# Altium project controller.PrjPcb
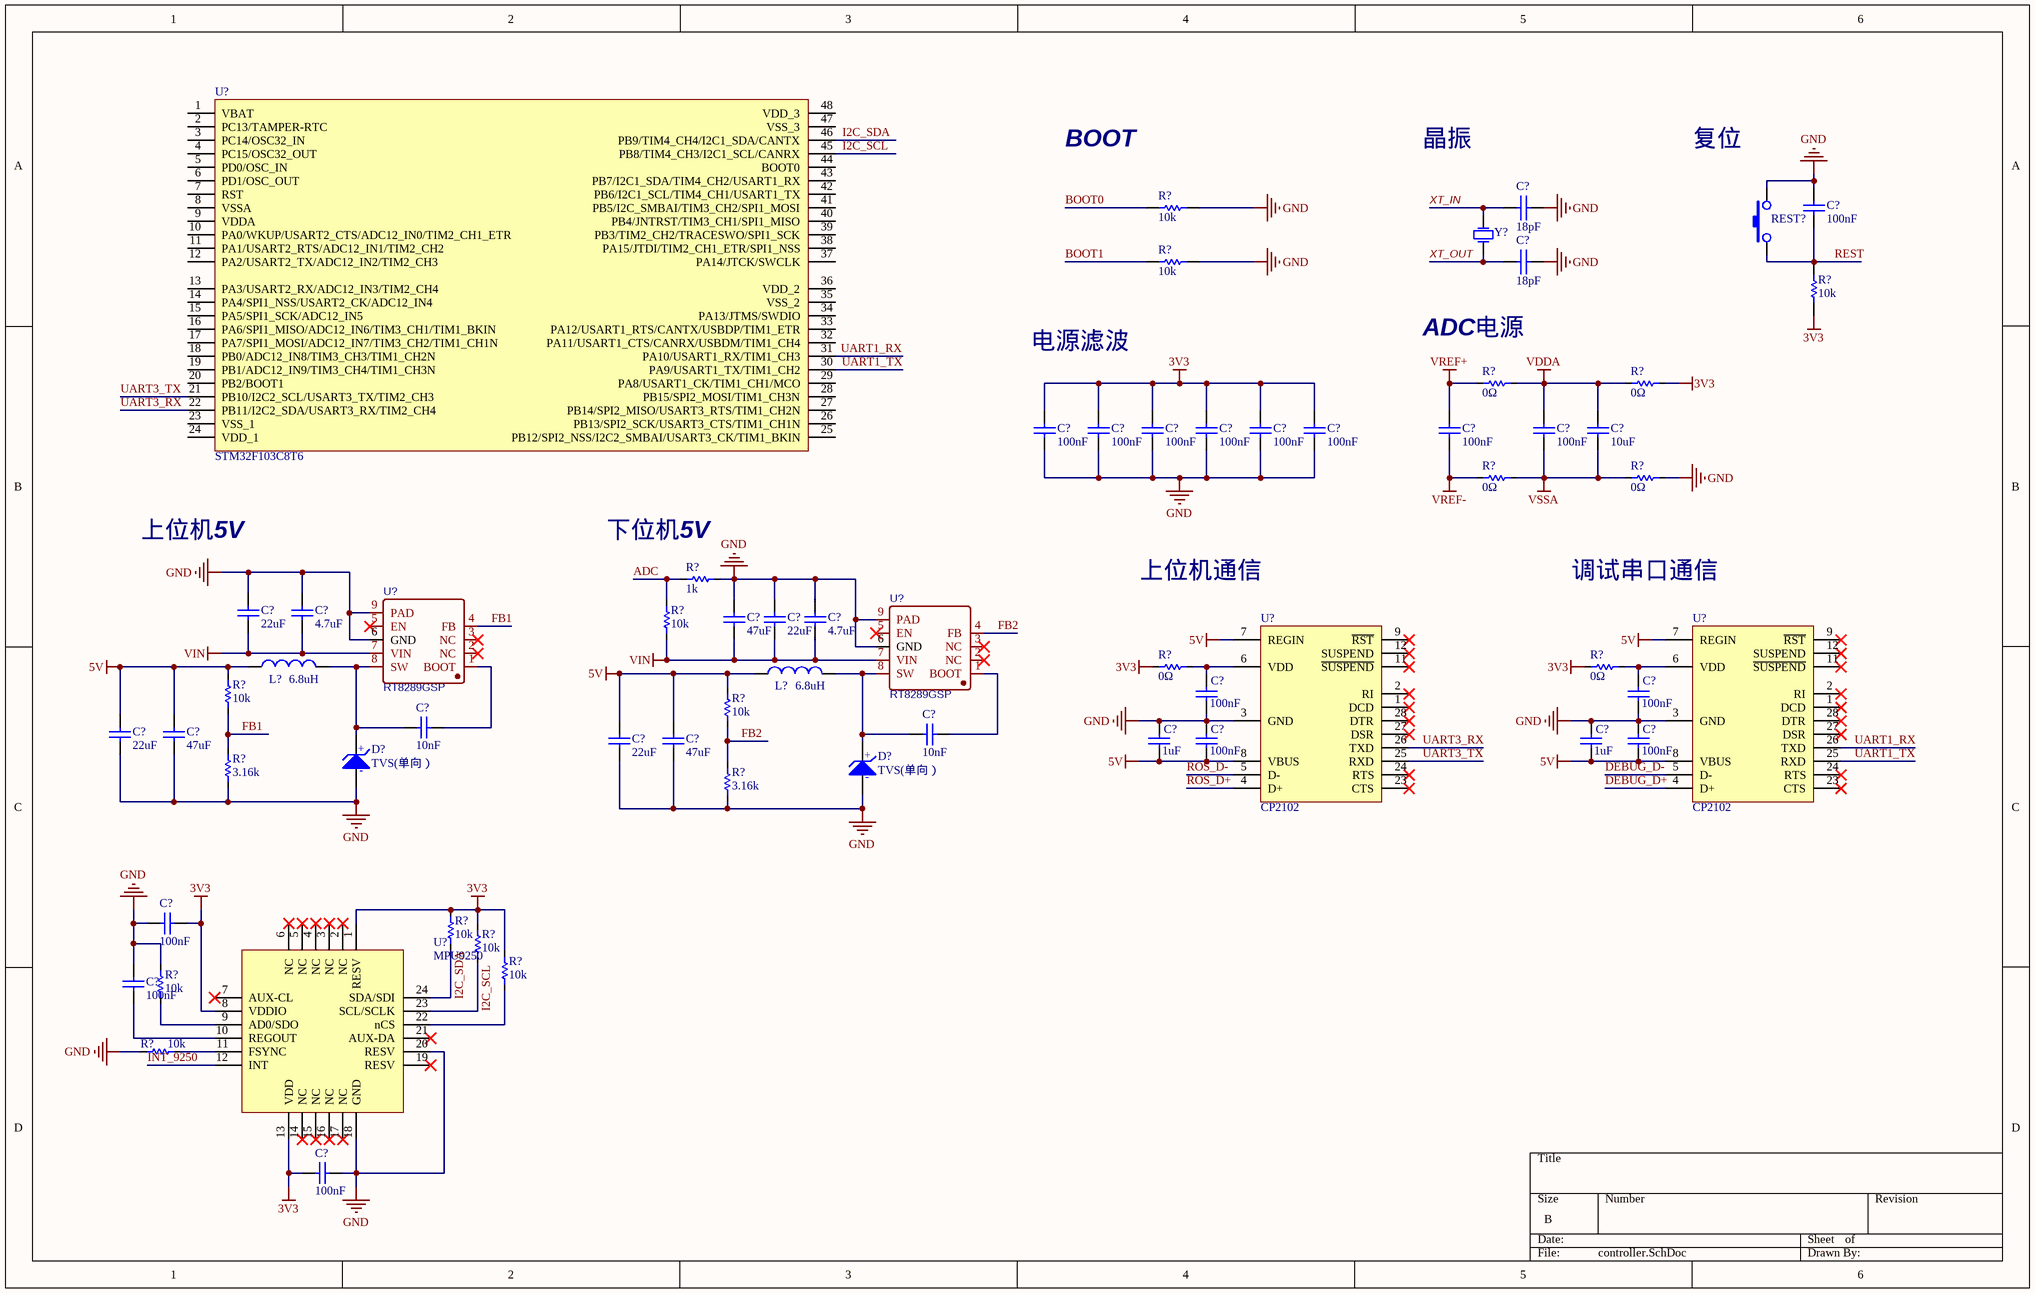
[diagram p0: controller.SchDoc]
1 sheet, 64 parts. Net scope: global (net labels, ports and power ports of the same name join across sheets).

## Sheet controller.SchDoc
size B; SheetNumber: 1; SheetTotal: 1

### Parts
(Parts that share a designator on the sheet are numbered #1, #2 ... from top to bottom, then left to right.)
C?#1  18pF  [0603C]
C?#2  100nF  [0603C]
C?#3  18pF  [0603C]
C?#4  100nF  [0603C]
C?#5  100nF  [0603C]
C?#6  100nF  [0603C]
C?#7  100nF  [0603C]
C?#8  100nF  [0603C]
C?#9  100nF  [0603C]
C?#10  100nF  [0603C]
C?#11  100nF  [0603C]
C?#12  10uF  [0805c]
C?#13  22uF  [0805c]
C?#14  4.7uF  [0805c]
C?#15  47uF  [0805c]
C?#16  22uF  [0805c]
C?#17  4.7uF  [0805c]
C?#18  100nF  [0603C]
C?#19  100nF  [0603C]
C?#20  10nF  [0603C]
C?#21  22uF  [0805c]
C?#22  47uF  [0805c]
C?#23  10nF  [0603C]
C?#24  22uF  [0805c]
C?#25  47uF  [0805c]
C?#26  1uF  [0603C]
C?#27  100nF  [0603C]
C?#28  1uF  [0603C]
C?#29  100nF  [0603C]
C?#30  100nF  [0603C]
C?#31  100nF  [0603C]
C?#32  100nF  [0603C]
D?#1  TVS(单向）  [SMB/DO-214AA]
D?#2  TVS(单向）  [SMB/DO-214AA]
L?#1  6.8uH  [XAL6060]
L?#2  6.8uH  [XAL6060]
R?#1  10k  [0603R]
R?#2  10k  [0603R]
R?#3  10k  [0603R]
R?#4  0Ω  [0603R]
R?#5  0Ω  [0603R]
R?#6  0Ω  [0603R]
R?#7  0Ω  [0603R]
R?#8  1k  [0603R]
R?#9  10k  [0603R]
R?#10  0Ω  [0603R]
R?#11  0Ω  [0603R]
R?#12  10k  [0603R]
R?#13  10k  [0603R]
R?#14  3.16k  [0603R]
R?#15  3.16k  [0603R]
R?#16  10k  [0603R]
R?#17  10k  [0603R]
R?#18  10k  [0603R]
R?#19  10k  [0603R]
R?#20  10k  [0603R]
REST?  KEY  [SMD-3X6X2.5]  (value not drawn)
U?#1  STM32F103C8T6  [LQFP_48]
U?#2  RT8289GSP  [RT8289GSP]
U?#3  RT8289GSP  [RT8289GSP]
U?#4  CP2102  [QFN50P500X500X90-28N(CP2101)]
U?#5  CP2102  [QFN50P500X500X90-28N(CP2101)]
U?#6  MPU9250  [QFN24 3x3]
Y?  XTAL  [NX5032GA]  (value not drawn)

### Nets
3V3: C?#4.2 C?#5.2 C?#6.2 C?#7.2 C?#8.2 C?#9.2 C?#30.1 C?#32.2 R?#3.2 R?#5.2 R?#10.2 R?#11.2 R?#16.2 R?#17.2 R?#18.2 U?#6.1(RESV) U?#6.8(VDDIO) U?#6.13(VDD)
5V: C?#21.2 C?#22.2 C?#24.2 C?#25.2 C?#26.2 C?#27.2 C?#28.2 C?#29.2 L?#1.1 L?#2.1 R?#12.2 R?#13.2 U?#4.7(REGIN) U?#4.8(VBUS) U?#5.7(REGIN) U?#5.8(VBUS)
GND: C?#1.2 C?#2.2 C?#3.2 C?#4.1 C?#5.1 C?#6.1 C?#7.1 C?#8.1 C?#9.1 C?#13.2 C?#14.2 C?#15.2 C?#16.2 C?#17.2 C?#18.2 C?#19.2 C?#21.1 C?#22.1 C?#24.1 C?#25.1 C?#26.1 C?#27.1 C?#28.1 C?#29.1 C?#30.2 C?#31.2 C?#32.1 D?#1.1 D?#2.1 R?#1.1 R?#2.1 R?#7.2 R?#8.1 R?#14.1 R?#15.1 R?#19.2 R?#20.1 REST?.3 U?#2.6(GND) U?#2.9(PAD) U?#3.6(GND) U?#3.9(PAD) U?#4.3(GND) U?#4.29(PAD) U?#5.3(GND) U?#5.29(PAD) U?#6.18(GND) U?#6.20(RESV)
VDDA: C?#11.2 C?#12.2 R?#4.2 R?#5.1
VIN: C?#13.1 C?#14.1 C?#15.1 C?#16.1 C?#17.1 R?#9.2 U?#2.7(VIN) U?#3.7(VIN)
VREF+: C?#10.2 R?#4.1
VREF-: C?#10.1 R?#6.1
VSSA: C?#11.1 C?#12.1 R?#6.2 R?#7.1
ADC: R?#8.2 R?#9.1
BOOT0: R?#1.2
BOOT1: R?#2.2
DEBUG_D+: U?#5.4(D+)
DEBUG_D-: U?#5.5(D-)
FB1: R?#12.1 R?#14.2 U?#2.4(FB)
FB2: R?#13.1 R?#15.2 U?#3.4(FB)
I2C_SCL: R?#17.1 U?#1.45(PB8/TIM4_CH3/I2C1_SCL/CANRX) U?#6.23(SCL/SCLK)
I2C_SDA: R?#16.1 U?#1.46(PB9/TIM4_CH4/I2C1_SDA/CANTX) U?#6.24(SDA/SDI)
INT_9250: U?#6.12(INT)
REST: C?#2.1 R?#3.1 REST?.1
ROS_D+: U?#4.4(D+)
ROS_D-: U?#4.5(D-)
UART1_RX: U?#1.31(PA10/USART1_RX/TIM1_CH3) U?#5.26(TXD)
UART1_TX: U?#1.30(PA9/USART1_TX/TIM1_CH2) U?#5.25(RXD)
UART3_RX: U?#1.22(PB11/I2C2_SDA/USART3_RX/TIM2_CH4) U?#4.26(TXD)
UART3_TX: U?#1.21(PB10/I2C2_SCL/USART3_TX/TIM2_CH3) U?#4.25(RXD)
XT_IN: C?#1.1 Y?.1(OSC1)
XT_OUT: C?#3.1 Y?.2(OSC2)
NetC?#18_1: C?#18.1 R?#10.1 U?#4.6(VDD)
NetC?#19_1: C?#19.1 R?#11.1 U?#5.6(VDD)
NetC?#20_1: C?#20.1 U?#2.1(BOOT)
NetC?#20_2: C?#20.2 D?#1.2 L?#1.2 U?#2.8(SW)
NetC?#23_1: C?#23.1 U?#3.1(BOOT)
NetC?#23_2: C?#23.2 D?#2.2 L?#2.2 U?#3.8(SW)
NetC?#31_1: C?#31.1 U?#6.10(REGOUT)
NetR?#18_1: R?#18.1 U?#6.22(nCS)
NetR?#19_1: R?#19.1 U?#6.9(AD0/SDO)
NetR?#20_2: R?#20.2 U?#6.11(FSYNC)

Not connected (* = marked no-connect by the designer): U?#1 1(VBAT) 2(PC13/TAMPER-RTC) 3(PC14/OSC32_IN) 4(PC15/OSC32_OUT) 5(PD0/OSC_IN) 6(PD1/OSC_OUT) 7(RST) 8(VSSA) 9(VDDA) 10(PA0/WKUP/USART2_CTS/ADC12_IN0/TIM2_CH1_ETR) 11(PA1/USART2_RTS/ADC12_IN1/TIM2_CH2) 12(PA2/USART2_TX/ADC12_IN2/TIM2_CH3) 13(PA3/USART2_RX/ADC12_IN3/TIM2_CH4) 14(PA4/SPI1_NSS/USART2_CK/ADC12_IN4) 15(PA5/SPI1_SCK/ADC12_IN5) 16(PA6/SPI1_MISO/ADC12_IN6/TIM3_CH1/TIM1_BKIN) 17(PA7/SPI1_MOSI/ADC12_IN7/TIM3_CH2/TIM1_CH1N) 18(PB0/ADC12_IN8/TIM3_CH3/TIM1_CH2N) 19(PB1/ADC12_IN9/TIM3_CH4/TIM1_CH3N) 20(PB2/BOOT1) 23(VSS_1) 24(VDD_1) 25(PB12/SPI2_NSS/I2C2_SMBAI/USART3_CK/TIM1_BKIN) 26(PB13/SPI2_SCK/USART3_CTS/TIM1_CH1N) 27(PB14/SPI2_MISO/USART3_RTS/TIM1_CH2N) 28(PB15/SPI2_MOSI/TIM1_CH3N) 29(PA8/USART1_CK/TIM1_CH1/MCO) 32(PA11/USART1_CTS/CANRX/USBDM/TIM1_CH4) 33(PA12/USART1_RTS/CANTX/USBDP/TIM1_ETR) 34(PA13/JTMS/SWDIO) 35(VSS_2) 36(VDD_2) 37(PA14/JTCK/SWCLK) 38(PA15/JTDI/TIM2_CH1_ETR/SPI1_NSS) 39(PB3/TIM2_CH2/TRACESWO/SPI1_SCK) 40(PB4/JNTRST/TIM3_CH1/SPI1_MISO) 41(PB5/I2C_SMBAI/TIM3_CH2/SPI1_MOSI) 42(PB6/I2C1_SCL/TIM4_CH1/USART1_TX) 43(PB7/I2C1_SDA/TIM4_CH2/USART1_RX) 44(BOOT0) 47(VSS_3) 48(VDD_3); U?#2 2(NC)* 3(NC)* 5(EN)*; U?#3 2(NC)* 3(NC)* 5(EN)*; U?#4 1(DCD)* 2(RI)* 9(~{RST})* 11(~{SUSPEND})* 12(SUSPEND)* 23(CTS)* 24(RTS)* 27(DSR)* 28(DTR)*; U?#5 1(DCD)* 2(RI)* 9(~{RST})* 11(~{SUSPEND})* 12(SUSPEND)* 23(CTS)* 24(RTS)* 27(DSR)* 28(DTR)*; U?#6 2(NC)* 3(NC)* 4(NC)* 5(NC)* 6(NC)* 7(AUX-CL)* 14(NC)* 15(NC)* 16(NC)* 17(NC)* 19(RESV)* 21(AUX-DA)*

### Notes on the sheet
- BOOT
- 晶振
- 复位
- 电源滤波
- ADC电源
- 上位机5V
- (near R?#8) 下位机5V
- 上位机通信
- 调试串口通信
- (in symbol TVS(单向）) +; -

### Library data of the parts
C?#1 C?#3 = CAP: 无极性电容
C?#2 C?#4-C?#32 = Cap: Capacitor; Value: 100pF; Published: 8-Jun-2000; LatestRevisionDate: 17-Jul-2002; LatestRevisionNote: Re-released for DXP Platform.; PackageReference: RAD-0.3; Publisher: Altium Limited; PackageDescription: Radial Cap, Thru-Hole; 2 Leads; 0.3 in Pin Spacing
L?#1 L?#2 = Inductor: Code_IEC: 1005; Value: 10mH; Published: 8-Jun-2000; LatestRevisionDate: 29-May-2009; LatestRevisionNote: IPC-7351 Footprint Added.; PackageReference: 0402-A; Publisher: Altium Limited; PackageDescription: Chip Inductor; Code_JEITA: 0402
R?#1-R?#3 = RES
R?#4-R?#7 R?#9-R?#20 = Res1: Resistor; Value: 1K; Published: 8-Jun-2000; LatestRevisionDate: 17-Jul-2002; LatestRevisionNote: Re-released for DXP Platform.; PackageReference: AXIAL-0.3; Publisher: Altium Limited; PackageDescription: Axial Device, Thru-Hole; 2 Leads; 0.3 in Pin Spacing
R?#8 = Res1: Resistor; Published: 8-Jun-2000; LatestRevisionDate: 17-Jul-2002; LatestRevisionNote: Re-released for DXP Platform.; PackageReference: AXIAL-0.3; Publisher: Altium Limited; PackageDescription: Axial Device, Thru-Hole; 2 Leads; 0.3 in Pin Spacing; Value: 1K
U?#2 U?#3 = RT8289GSP: BOM_Manufacturer: RICHTEK; BOM_Supplier: LCSC; BOM_Manufacturer Part: RT8289GSP; BOM_Supplier Part: C39202; BOM_JLCPCB Part Class: Extended Part; spicePre: U; spiceSymbolName: RT8289GSP
U?#6 = MPU9250: 9轴运动处理传感器
Y? = XTAL: Crystal Oscillator; Published: 8-Jun-2000; LatestRevisionDate: 17-Jul-2002; LatestRevisionNote: Re-released for DXP Platform.; PackageReference: R38; Publisher: Altium Limited; PackageDescription: Crystal, Thru-Hole; 2 Leads; Body 3.1 x 8.2 mm (Dia.xH)